# EAGLE schematic PrimaryBoard (EAGLE 9.4.2)
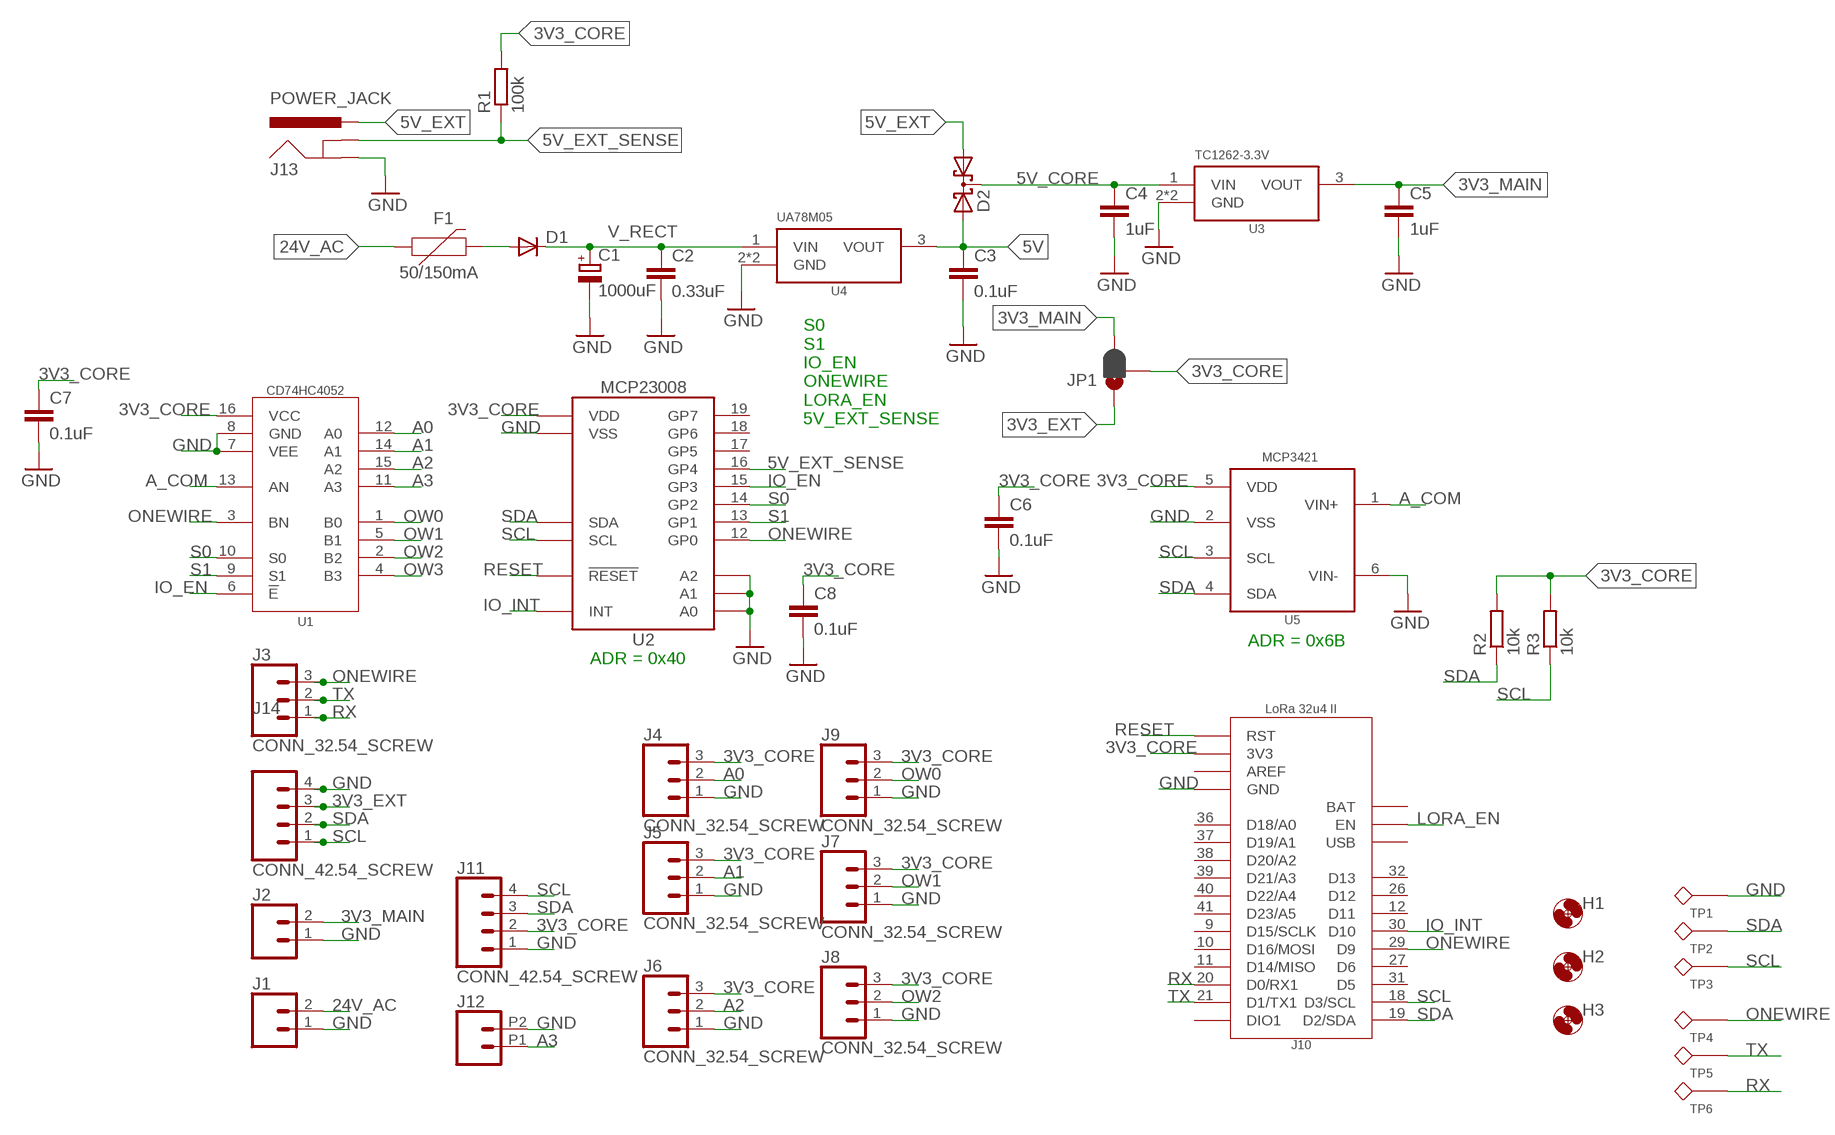
[diagram p0: schematic, sheet 1]

## Parts
C1  1000uF  CPOL-EUG  [PANASONIC_G]
C2  0.33uF  C-EU0.33UFC0805  [C0805]
C3  0.1uF  C-EU0.1UFC0805  [C0805]
C4  1uF  C-EU1UFC0805  [C0805]
C5  1uF  C-EU1UFC0805  [C0805]
C6  0.1uF  C-EU0.1UFC0805  [C0805]
C7  0.1uF  C-EU0.1UFC0805  [C0805]
C8  0.1uF  C-EU0.1UFC0805  [C0805]
D1  DIODESOD-123  [SOD-123]
D2  DIODE_CCSDM40E20LCSOT23  [SOT23-3]
F1  50/150mA  PPTC150MA1206  [1206]
H1  MOUNTING_HOLE2_NP  [2_56]
H2  MOUNTING_HOLE2_NP  [2_56]
H3  MOUNTING_HOLE2_NP  [2_56]
J1  CONN_0239532_RA  [1X02_39532_RIGHT]
J2  CONN_023.5MM-NO_SILK  [SCREWTERMINAL-3.5MM-2-NS]
J3  CONN_32.54_SCREW  [1X03_SCREW]
J4  CONN_32.54_SCREW  [1X03_SCREW]
J5  CONN_32.54_SCREW  [1X03_SCREW]
J6  CONN_32.54_SCREW  [1X03_SCREW]
J7  CONN_32.54_SCREW  [1X03_SCREW]
J8  CONN_32.54_SCREW  [1X03_SCREW]
J9  CONN_32.54_SCREW  [1X03_SCREW]
J10  LORA32U4II  [LORA32U4II]
J11  CONN_42.54_SCREW  [1X04_SCREW]
J12  CONN_022.54_SCREW  [1X02_2.54_SCREWTERM]
J13  POWER_JACK  [POWER_JACK_PTH]
J14  CONN_42.54_SCREW  [1X04_SCREW]
JP1  JUMPER-SMT_3_1-NC_PASTE_SILK  [SMT-JUMPER_3_1-NC_PASTE_SILK]
R1  100k  R-EU_100KR0805  [R0805]
R2  10k  R-EU_10KR0805  [R0805]
R3  10k  R-EU_10KR0805  [R0805]
TP1  TESTPOINTRCU  [TESTPOINT_0603]
TP2  TESTPOINTRCU  [TESTPOINT_0603]
TP3  TESTPOINTRCU  [TESTPOINT_0603]
TP4  TESTPOINTRCU  [TESTPOINT_0603]
TP5  TESTPOINTRCU  [TESTPOINT_0603]
TP6  TESTPOINTRCU  [TESTPOINT_0603]
U1  CD74HC4052PW  [TSSOP16]
U2  MCP23008SSOP  [SSOP20]
U3  TC1262-3.3V  [SOT223]
U4  UA78M05SOT223  [SOT223]
U5  MCP3421A3  [SOT23-6L]

## Nets
3V3_CORE: C6.1 C7.1 C8.1 J4.3 J5.3 J6.3 J7.3 J8.3 J9.3 J10.3V3 J11.2 JP1.2 R1.2 R2.2 R3.2 U1.16(VCC) U2.20(VDD) U5.5(VDD)
3V3_EXT: J14.3 JP1.1
3V3_MAIN: C5.1 J2.2 JP1.3 U3.3(VOUT)
5V: C3.1 D2.2(A2) U4.3(VOUT)
5V_CORE: C4.1 D2.3(C) U3.1(VIN)
5V_EXT: D2.1(A1) J13.PWR
5V_EXT_SENSE: J13.GNDBREAK R1.1 U2.16(GP4)
24V_AC: F1.1 J1.2
A0: J4.2 U1.12(A0)
A1: J5.2 U1.14(A1)
A2: J6.2 U1.15(A2)
A3: J12.P1 U1.11(A3)
A_COM: U1.13(AN) U5.1(VIN+)
GND: C1.- C2.2 C3.2 C4.2 C5.2 C6.2 C7.2 C8.2 J1.1 J2.1 J4.1 J5.1 J6.1 J7.1 J8.1 J9.1 J10.GND J11.1 J12.P2 J13.GND J14.4 TP1.1 U1.7(VEE) U1.8(GND) U2.3(A2) U2.4(A1) U2.5(A0) U2.9(VSS) U3.2(GND) U3.4(GND) U4.2(GND) U4.4(GND) U5.2(VSS) U5.6(VIN-)
IO_EN: U1.6(!E) U2.15(GP3)
IO_INT: J10.30(D10) U2.8(INT)
LORA_EN: J10.EN
N$3: D1.ANODE(A) F1.2
ONEWIRE: J3.3 J10.29(D9) TP4.1 U1.3(BN) U2.12(GP0)
OW0: J9.2 U1.1(B0)
OW1: J7.2 U1.5(B1)
OW2: J8.2 U1.2(B2)
OW3: U1.4(B3)
RESET: J10.RST U2.6(!RESET)
RX: J3.1 J10.20(D0/RX1) TP6.1
S0: U1.10(S0) U2.14(GP2)
S1: U1.9(S1) U2.13(GP1)
SCL: J10.18(D3/SCL) J11.4 J14.1 R3.1 TP3.1 U2.1(SCL) U5.3(SCL)
SDA: J10.19(D2/SDA) J11.3 J14.2 R2.1 TP2.1 U2.2(SDA) U5.4(SDA)
TX: J3.2 J10.21(D1/TX1) TP5.1
V_RECT: C1.+ C2.1 D1.CAT(C) U4.1(VIN)
Unconnected: J10.9(D15/SCLK) J10.10(D16/MOSI) J10.11(D14/MISO) J10.12(D11) J10.26(D12) J10.27(D6) J10.31(D5) J10.32(D13) J10.36(D18/A0) J10.37(D19/A1) J10.38(D20/A2) J10.39(D21/A3) J10.40(D22/A4) J10.41(D23/A5) J10.AREF J10.DIO1 U2.17(GP5) U2.18(GP6) U2.19(GP7)

## Notes on the sheet
- S0
  S1
  IO_EN
  ONEWIRE
  LORA_EN
  5V_EXT_SENSE
- ADR = 0x6B
- ADR = 0x40

## Power pins joined to a net without a drawn wire
BAT: J10.BAT
USB: J10.USB

## Library data of the parts
C1 = bschulz_passives:CPOL-EU: POLARIZED CAPACITOR, European symbol; DIGIKEY: P122428CT-ND; MF: Panasonic; MPN: EEE-FT1E102UP; SPICEPREFIX: C
C2 = bschulz_passives:C-EU: CAPACITOR, European symbol; DIGIKEY: 311-1888-1-ND; MF: Yageo; MPN: CC0805KKX7R9BB334
C3 C6-C8 = bschulz_passives:C-EU: CAPACITOR, European symbol; DIGIKEY: 399-8000-1-ND; MF: Kemet; MPN: C0805C104M3RACTU
C4 C5 = bschulz_passives:C-EU: CAPACITOR, European symbol; DIGIKEY: 311-1456-1-ND; MF: Yageo; MPN: CC0805KKX7R8BB105
D1 = bschulz:DIODE: Genaric Diode; DIGIKEY: 1N5819HW-FDICT-ND; MF: Diodes Incorporated; MPN: 1N5819HW-7-F
D2 = bschulz:DIODE_CC: Dual Diode, Common Cathode BAT54C Vr, max: 30V Iavg: 200mA Vf: 800mv @ 100mA Reverse Leakage: 2μA @ 25V SDM40E20LC Vr, max: 20V Iavg: 400mA Vf: 310mv @ 100mA Reverse Leakage: 250μA @ 20V; DIGIKEY: SDM40E20LC-7DICT-ND; MF: Diodes Incorporated; MPN: SDM40E20LC-7
F1 = bschulz:PPTC: Bel Fuse PPTC; DIGIKEY: 507-1793-1-ND; MF: Bell Fuse; MPN: 0ZCJ0005FF2E
H1-H3 = bschulz:MOUNTING_HOLE: Genaric Mechanical Mounting Hole Hole diameter based on max body diameter + 15% Keepout ring is for diameter of socket cap screw (minimum required clearance) TPlace ring is for diameter of pan head screw (recomended clearance) Specifications: Socket Cap <http://fastener-express.com/fastener-technical/SocketscapSS-Alloy.pdf> Button Head Socket Cap <http://fastener-express.com/fastener-technical/Button-Socket-alloy.pdf> Pan Head <http://fastener-express.com/fastener-technical/pan-machine-Screws.pdf>
J1 = bschulz:CONN_02: Genaric 2 terminal header SCREW_2.54 <https://www.digikey.com/product-detail/en/on-shore-technology-inc/OSTVN02A150/ED10561-ND/1588862> 39532_RA <https://www.digikey.com/product-detail/en/molex/0395321002/WM7845-ND/1280696>; DIGIKEY: WM7845-ND; MF: Molex; MPN: 0395321002
J2 = bschulz:CONN_02: Genaric 2 terminal header SCREW_2.54 <https://www.digikey.com/product-detail/en/on-shore-technology-inc/OSTVN02A150/ED10561-ND/1588862> 39532_RA <https://www.digikey.com/product-detail/en/molex/0395321002/WM7845-ND/1280696>; DIGIKEY: ED2635-ND; MF: On Shore Technology; MPN: OSTTE020161; PROD_ID: CONN-08399
J3-J9 = bschulz:CONN_3: Genaric 3 terminal header Digikey 2.54_SCREW <https://www.digikey.com/product-detail/en/on-shore-technology-inc/OSTVN03A150/ED10562-ND/1588863> 3.5_SCREW <https://www.digikey.com/product-detail/en/on-shore-technology-inc/OSTTE030161/ED2636-ND/614585>; DIGIKEY: ED10562-ND; MF: On Shore; MPN: OSTVN03A150
J10 = bschulz:LORA32U4II: LoRa 32u4 Mounting Header Mounting header designed for the LoRa 32u4 unit built by BSFrance <https://bsfrance.fr/lora-long-range/1345-LoRa32u4-II-Lora-LiPo-Atmega32u4-SX1276-HPD13-868MHZ-EU-Antenna.html>
J11 J14 = bschulz:CONN_4: Genaric 4 terminal header Digikey 2.54_SCREW <https://www.digikey.com/product-detail/en/on-shore-technology-inc/OSTVN04A150/ED10563-ND/1588864>; DIGIKEY: ED10563-ND; MF: On Shore; MPN: OSTVN04A150
J12 = bschulz:CONN_02: Genaric 2 terminal header SCREW_2.54 <https://www.digikey.com/product-detail/en/on-shore-technology-inc/OSTVN02A150/ED10561-ND/1588862> 39532_RA <https://www.digikey.com/product-detail/en/molex/0395321002/WM7845-ND/1280696>; DIGIKEY: ED10561-ND; MF: OnShore; MPN: OSTVN02A150
J13 = bschulz:POWER_JACK: Power Jack Connector This is the standard 5.5mm barrel jack for power. The PTH is the most common, proven, reliable, footprint. The Slot footprint only works if the mill layer is transmitted to the PCB fab house so be warned. Here are the connectors we sell at SparkFun: DC Barrel Power Jack/Connector <https://www.sparkfun.com/products/119> (PRT-00119) DC Barrel Power Jack/Connector (SMD) <https://www.sparkfun.com/products/12748> (PRT-12748) DC Barrel Jack Adapter - Breadboard Compatible <https://www.sparkfun.com/products/10811> (PRT-10811) It is used on this SparkFun product (and many, many others): SparkFun RedBoard - Programmed with Arduino <https://www.sparkfun.com/products/12757> (DEV-12757) Also, if you need a mating power supply or connector, please check these out: Wall Adapter Power Supply - 9VDC 650mA <https://www.sparkfun.com/products/298> (TOL-00298) DC Barrel Jack Adapter - Male <https://www.sparkfun.com/products/10287> (PRT-10287); DIGIKEY: CP-202A-ND; MF: CUI; MPN: PJ-202A; PROD_ID: CONN-08197
JP1 = SparkFun-Jumpers:JUMPER-SMT_3_1-NC_PASTE: Normally closed solder jumper (1 of 2 connections) This jumper has an aperture in the stencil to allow solder paste to bridge one of the two connections. One connection is normally closed (NC), while the other is normally open (NO). Wick off the solder to open the connection. Reapply solder to reclose the connection. Apply solder to the other side instead to change the current path.
R1 = bschulz_passives:R-EU_: RESISTOR, European symbol Digikey Parts: Yageo, 0402 <https://www.digikey.com/products/en/resistors/chip-resistor-surface-mount/52?k=&pkeyword=&sf=0&FV=ffec1104%2Cfffc000d%2C1c0002%2C440067%2C1f140000%2Cffe00034%2C400004&quantity=&ColumnSort=0&page=1&stock=1&pageSize=25> Yageo, 0603 <https://www.digikey.com/products/en/resistors/chip-resistor-surface-mount/52?k=&pkeyword=&s=4356&s=47360&sf=0&FV=fffc000d%2C1c0002%2C142c040c%2C1f140000%2Cffe00034&quantity=10&ColumnSort=1000011&page=1&stock=1&pageSize=25> Panasonic, 0603 <https://www.digikey.com/products/en/resistors/chip-resistor-surface-mount/52?k=&pkeyword=&pv252=68&sf=0&FV=ffec373d%2C1c0002%2C142c040c%2C1f140000%2Cffe00034%2C80002%2Cc0001&quantity=&ColumnSort=0&page=1&stock=1&pageSize=25> Panasonic, precision, 0603 <https://www.digikey.com/products/en/resistors/chip-resistor-surface-mount/52?FV=ffec4907%2Cfffc000a%2Cc0172%2C142c040c%2C1f140000%2Cffe00034%2C1c0002&quantity=100&ColumnSort=2085&page=1&stock=1&pageSize=25> Panasonic, 0805 <https://www.digikey.com/products/en/resistors/chip-resistor-surface-mount/52?k=&pkeyword=&pv3=1&sf=0&FV=ffec373d%2C1c0002%2C1f140000%2Cffe00034%2C142c040d&quantity=&ColumnSort=0&page=1&stock=1&pageSize=25> Rohm, current sense <https://www.digikey.com/products/en/resistors/chip-resistor-surface-mount/52?k=&pkeyword=&pv3=1&sf=0&FV=ffecb688%2C1f140000%2Cffe00034%2C1c0002&quantity=&ColumnSort=0&page=1&stock=1&pageSize=25> Vishay, pulse proof automotive <https://www.digikey.com/products/en/resistors/chip-resistor-surface-mount/52?k=&pkeyword=&pv7=2&sf=0&FV=ffec5d6b%2Cffe00034%2C1f140000&quantity=&ColumnSort=0&page=1&stock=1&pageSize=25>; DIGIKEY: 311-100KCRCT-ND; MF: Yageo; MPN: RC0805FR-07100KL
R2 R3 = bschulz_passives:R-EU_: RESISTOR, European symbol Digikey Parts: Yageo, 0402 <https://www.digikey.com/products/en/resistors/chip-resistor-surface-mount/52?k=&pkeyword=&sf=0&FV=ffec1104%2Cfffc000d%2C1c0002%2C440067%2C1f140000%2Cffe00034%2C400004&quantity=&ColumnSort=0&page=1&stock=1&pageSize=25> Yageo, 0603 <https://www.digikey.com/products/en/resistors/chip-resistor-surface-mount/52?k=&pkeyword=&s=4356&s=47360&sf=0&FV=fffc000d%2C1c0002%2C142c040c%2C1f140000%2Cffe00034&quantity=10&ColumnSort=1000011&page=1&stock=1&pageSize=25> Panasonic, 0603 <https://www.digikey.com/products/en/resistors/chip-resistor-surface-mount/52?k=&pkeyword=&pv252=68&sf=0&FV=ffec373d%2C1c0002%2C142c040c%2C1f140000%2Cffe00034%2C80002%2Cc0001&quantity=&ColumnSort=0&page=1&stock=1&pageSize=25> Panasonic, precision, 0603 <https://www.digikey.com/products/en/resistors/chip-resistor-surface-mount/52?FV=ffec4907%2Cfffc000a%2Cc0172%2C142c040c%2C1f140000%2Cffe00034%2C1c0002&quantity=100&ColumnSort=2085&page=1&stock=1&pageSize=25> Panasonic, 0805 <https://www.digikey.com/products/en/resistors/chip-resistor-surface-mount/52?k=&pkeyword=&pv3=1&sf=0&FV=ffec373d%2C1c0002%2C1f140000%2Cffe00034%2C142c040d&quantity=&ColumnSort=0&page=1&stock=1&pageSize=25> Rohm, current sense <https://www.digikey.com/products/en/resistors/chip-resistor-surface-mount/52?k=&pkeyword=&pv3=1&sf=0&FV=ffecb688%2C1f140000%2Cffe00034%2C1c0002&quantity=&ColumnSort=0&page=1&stock=1&pageSize=25> Vishay, pulse proof automotive <https://www.digikey.com/products/en/resistors/chip-resistor-surface-mount/52?k=&pkeyword=&pv7=2&sf=0&FV=ffec5d6b%2Cffe00034%2C1f140000&quantity=&ColumnSort=0&page=1&stock=1&pageSize=25>; DIGIKEY: 311-10.0KCRCT-ND; MF: Yageo; MPN: RC0805FR-0710KL
TP1-TP6 = bschulz:TESTPOINT; DIGIKEY: A106145CT-ND; MF: TE Connectivity; MPN: RCU-0C
U1 = bschulz:CD74HC4052: CD74HC4052 - Dual 4x1 Analog Multiplexer/Demultiplexer Characteristics: VCC: 2 ~ 6V Vswitch: 0 ~ 10V Operating Temperature: -55°C to 125°C Digikey: 296-17619-1-ND (TSSOP) <https://www.digikey.com/product-detail/en/texas-instruments/CD74HC4052PWR/296-17619-1-ND/710465> 296-9218-5-ND (SOIC) <https://www.digikey.com/product-detail/en/texas-instruments/CD74HC4052M/296-9218-5-ND/376764> 296-9217-5-ND (DIP) <https://www.digikey.com/product-detail/en/texas-instruments/CD74HC4052E/296-9217-5-ND/376770>; DIGIKEY: 296-17619-1-ND; MF: TI; MPN: CD74HC4052PWR
U2 = bschulz:MCP23008: MCP23008 - I2C I/O Expander, 8 bit wtih interrupt and reset Characteristics: Vcc: 1.8V ~ 5.5V IOut: 25 mA IQ: 1μA Operating Temperature: -40°C to 85°C Internal Configurable Pullups Digikey: MCP23008T-E/MLCT-ND (QFN) <https://www.digikey.com/product-detail/en/microchip-technology/MCP23008T-E-ML/MCP23008T-E-MLCT-ND/7916525> MCP23008T-E/SOCT-ND (SOIC) <https://www.digikey.com/product-detail/en/microchip-technology/MCP23008T-E-SO/MCP23008T-E-SOCT-ND/5358243> MCP23008T-E/SSCT-ND (SSOP) <https://www.digikey.com/product-detail/en/microchip-technology/MCP23008T-E-SS/MCP23008T-E-SSCT-ND/5013523>; DIGIKEY: MCP23008T-E/SSCT-ND; MF: Microchip; MPN: MCP23008T-E/SS
U3 = bschulz:TC1262-*: TC1262-* - Positive Voltage Regulator Characteristics: Vin: 2.7V ~ 6V Vout: 2.5, 2.8, 3.0, 3.3, 5V fixed Output Current: 500 mA Dropout Voltage: 0.65V @ 500mA Operating Temperature: -40°C to 125°C Digikey: TC1262-3.3VDBCT-ND (3.3V) <https://www.digikey.com/product-detail/en/microchip-technology/TC1262-3.3VDBTR/TC1262-3.3VDBCT-ND/669517>; DIGIKEY: TC1262-3.3VDBCT-ND; DISP: TC1262-3.3V; MF: Microchip; MPN: TC1262-3.3VDBTR
U4 = bschulz:UA78M*: UA78M* - Positive Voltage Regulator Characteristics: Vin: 5.3V ~ 25V Vout: 3.3, 5, 6, 8, 9, 12, 12, 15V fixed Output Current: 500 mA Operating Temperature: -40°C to 125°C Digikey: UA78M05IDCYR (5V) <https://www.digikey.com/product-detail/en/texas-instruments/UA78M05IDCYR/296-17616-1-ND/706597>; DIGIKEY: 296-17616-1-ND; DISP: UA78M05; MF: TI; MPN: UA78M05IDCYR
U5 = bschulz:MCP342*: MCP342* - Sigma Delta ADC Characteristics: VCC: 2.7~5.5V Operating Temperature: -40°C to 125°C Number of Inputs: 1 (Differenital) Sample Rate: 15 Samples Per Second Number of Bits: 16 (MCP3425), 18 (MCP3421) Digikey: MCP3421 MCP3425A0T-E/CHCT-ND <https://www.digikey.com/product-detail/en/microchip-technology/MCP3425A0T-E-CH/MCP3425A0T-E-CHCT-ND/1979810> MCP3425 MCP3421A0T-E/CHCT-ND <https://www.digikey.com/product-detail/en/microchip-technology/MCP3421A0T-E-CH/MCP3421A0T-E-CHCT-ND/2183406> MCP3421A1T-E/CHCT-ND <https://www.digikey.com/product-detail/en/microchip-technology/MCP3421A1T-E-CH/MCP3421A1T-E-CHCT-ND/2183407> MCP3421A3T-E/CHCT-ND <https://www.digikey.com/product-detail/en/microchip-technology/MCP3421A3T-E-CH/MCP3421A3T-E-CHCT-ND/2183409>; DIGIKEY: MCP3421A3T-E/CHCT-ND; DISP: MCP3421; MF: Microchip; MPN: MCP3421A3T-E/CH